# EAGLE schematic Ladder_Filter_IF_Amplifier (EAGLE 5.07)
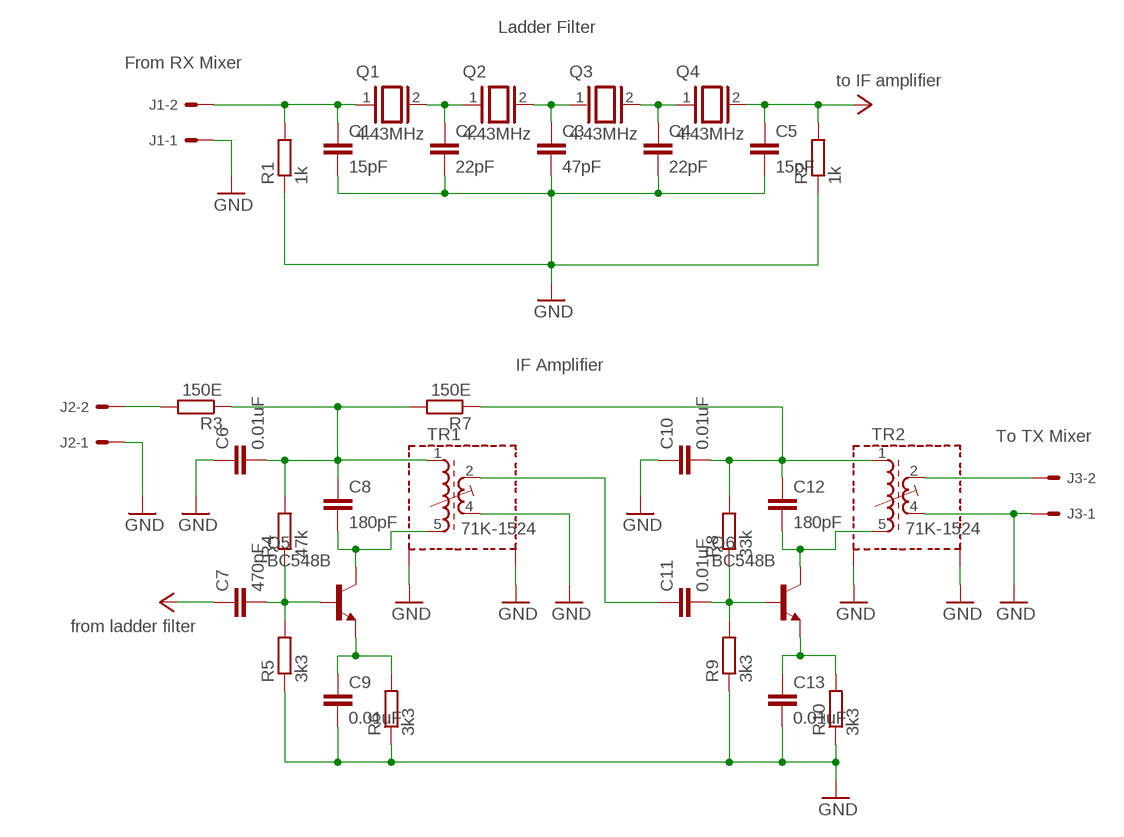
[diagram p0: schematic, sheet 1]

## Parts
C1  15pF  C-EU050-035X075  [C050-035X075]
C2  22pF  C-EU050-035X075  [C050-035X075]
C3  47pF  C-EU050-035X075  [C050-035X075]
C4  22pF  C-EU050-035X075  [C050-035X075]
C5  15pF  C-EU050-035X075  [C050-035X075]
C6  0.01uF  C-EU050-035X075  [C050-035X075]
C7  470pF  C-EU050-035X075  [C050-035X075]
C8  180pF  C-EU050-035X075  [C050-035X075]
C9  0.01uF  C-EU050-035X075  [C050-035X075]
C10  0.01uF  C-EU050-035X075  [C050-035X075]
C11  0.01uF  C-EU050-035X075  [C050-035X075]
C12  180pF  C-EU050-035X075  [C050-035X075]
C13  0.01uF  C-EU050-035X075  [C050-035X075]
J1  22-27-2021-02  [6410-02]
J2  22-27-2021-02  [6410-02]
J3  22-27-2021-02  [6410-02]
Q1  4.43MHz  XTAL/S  [QS]
Q2  4.43MHz  XTAL/S  [QS]
Q3  4.43MHz  XTAL/S  [QS]
Q4  4.43MHz  XTAL/S  [QS]
Q5  BC548B  [TO92-EBC]
Q6  BC548B  [TO92-EBC]
R1  1k  R-EU_0207/12  [0207/12]
R2  1k  R-EU_0207/12  [0207/12]
R3  150E  R-EU_0207/12  [0207/12]
R4  47k  R-EU_0207/12  [0207/12]
R5  3k3  R-EU_0207/12  [0207/12]
R6  3k3  R-EU_0207/12  [0207/12]
R7  150E  R-EU_0207/12  [0207/12]
R8  33k  R-EU_0207/12  [0207/12]
R9  3k3  R-EU_0207/12  [0207/12]
R10  3k3  R-EU_0207/12  [0207/12]
TR1  71K-1524  [71K]
TR2  71K-1524  [71K]

## Nets
GND: C1.2 C2.2 C3.2 C4.2 C5.2 C6.1 C9.2 C10.1 C13.2 J1.1 J2.1 J3.1 R1.1 R2.1 R5.1 R6.1 R9.1 R10.1 TR1.4(E2) TR1.S1 TR1.S2 TR2.4(E2) TR2.S1 TR2.S2
LADDER: C5.1 C7.1 Q4.2 R2.2 ; supply symbol labelled from ladder filter, to IF amplifier
N$1: C2.1 Q1.2 Q2.1
N$2: C3.1 Q2.2 Q3.1
N$3: C4.1 Q3.2 Q4.1
N$4: J2.2 R3.2
N$5: C7.2 Q5.B R4.1 R5.2
N$6: C6.2 C8.1 R3.1 R4.2 R7.2 TR1.1(A1)
N$7: C9.1 Q5.E R6.2
N$8: J3.2 TR2.2(A2)
N$9: C10.2 C12.1 R7.1 R8.2 TR2.1(A1)
N$10: C11.2 Q6.B R8.1 R9.2
N$11: C13.1 Q6.E R10.2
N$13: C8.2 Q5.C TR1.5(E1)
N$15: C11.1 TR1.2(A2)
N$16: C12.2 Q6.C TR2.5(E1)
N$18: C1.1 J1.2 Q1.1 R1.2

## Notes on the sheet
- Ladder Filter
- From RX Mixer
- IF Amplifier
- To TX Mixer

## Library data of the parts
C1-C13 = rcl:C-EU: CAPACITOR, European symbol
J1-J3 = con-molex:22-?-02: CONNECTOR wire to board 2.54 mm (.1 inch) pitch header
Q1-Q4 = special:XTAL/S: CRYSTAL
Q5 Q6 = transistor-npn:BC548*: NPN Transistor
R1-R10 = rcl:R-EU_: RESISTOR, European symbol
TR1 TR2 = inductor-neosid:71K-: TRANSFORMER adjustable filter transformer, type K